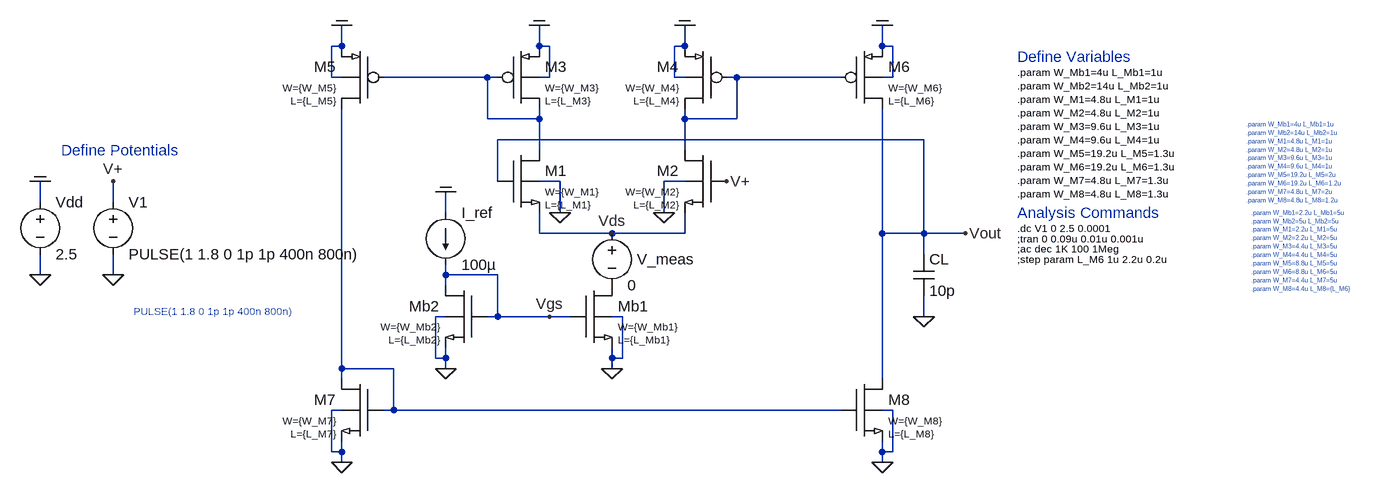
[diagram p0: schematic Wide_Output_OTA.asc]
Wide_Output_OTA.asc, the LTspice schematic file:
Version 4
SHEET 1 1488 680
WIRE -80 -96 -80 -128
WIRE -80 -96 -96 -96
WIRE 224 -96 224 -128
WIRE 240 -96 224 -96
WIRE 448 -96 448 -128
WIRE 448 -96 432 -96
WIRE 752 -96 752 -128
WIRE 768 -96 752 -96
WIRE -96 -48 -96 -96
WIRE -80 -48 -96 -48
WIRE 144 -48 -16 -48
WIRE 160 -48 144 -48
WIRE 240 -48 240 -96
WIRE 240 -48 224 -48
WIRE 432 -48 432 -96
WIRE 448 -48 432 -48
WIRE 528 -48 512 -48
WIRE 688 -48 528 -48
WIRE 768 -48 768 -96
WIRE 768 -48 752 -48
WIRE 144 16 144 -48
WIRE 224 16 224 0
WIRE 224 16 144 16
WIRE 448 16 448 0
WIRE 528 16 528 -48
WIRE 528 16 448 16
WIRE 816 48 160 48
WIRE 224 64 224 16
WIRE 448 64 448 16
WIRE 160 112 160 48
WIRE 256 112 224 112
WIRE 448 112 416 112
WIRE -544 144 -544 112
WIRE -432 144 -432 112
WIRE 80 160 80 128
WIRE 256 160 256 112
WIRE 416 160 416 112
WIRE 224 192 224 160
WIRE 336 192 224 192
WIRE 448 192 448 160
WIRE 448 192 336 192
WIRE 752 192 752 0
WIRE 816 192 816 48
WIRE 816 192 752 192
WIRE 880 192 816 192
WIRE 816 224 816 192
WIRE -544 256 -544 224
WIRE -432 256 -432 224
WIRE 80 256 80 240
WIRE 160 256 80 256
WIRE 80 272 80 256
WIRE 80 320 64 320
WIRE 160 320 160 256
WIRE 160 320 144 320
WIRE 240 320 160 320
WIRE 272 320 240 320
WIRE 352 320 336 320
WIRE 816 320 816 288
WIRE 64 384 64 320
WIRE 80 384 80 368
WIRE 80 384 64 384
WIRE 336 384 336 368
WIRE 352 384 352 320
WIRE 352 384 336 384
WIRE -80 400 -80 0
WIRE 0 400 -80 400
WIRE 80 400 80 384
WIRE 336 400 336 384
WIRE -80 416 -80 400
WIRE 752 416 752 192
WIRE -80 464 -96 464
WIRE 0 464 0 400
WIRE 0 464 -16 464
WIRE 688 464 0 464
WIRE 768 464 752 464
WIRE -96 528 -96 464
WIRE -80 528 -80 512
WIRE -80 528 -96 528
WIRE 752 528 752 512
WIRE 768 528 768 464
WIRE 768 528 752 528
WIRE -80 544 -80 528
WIRE 752 544 752 528
FLAG 80 400 0
FLAG 336 400 0
FLAG -80 544 0
FLAG 752 544 0
FLAG -80 -128 COM
FLAG 224 -128 COM
FLAG 448 -128 COM
FLAG 752 -128 COM
FLAG 256 160 0
FLAG 416 160 0
FLAG 80 128 COM
FLAG -544 112 COM
FLAG -544 256 0
FLAG 512 112 V+
FLAG -432 256 0
FLAG 816 320 0
FLAG 880 192 Vout
FLAG -432 112 V+
FLAG 336 192 Vds
FLAG 240 320 Vgs
SYMBOL EE551\\NMOS4 160 112 R0
WINDOW 123 73 16 Left 1
WINDOW 39 73 36 Left 1
SYMATTR Value2 W={W_M1}
SYMATTR SpiceLine L={L_M1}
SYMATTR InstName M1
SYMBOL EE551\\NMOS4 512 112 M0
WINDOW 123 73 16 Left 1
WINDOW 39 73 36 Left 1
SYMATTR Value2 W={W_M2}
SYMATTR SpiceLine L={L_M2}
SYMATTR InstName M2
SYMBOL EE551\\NMOS4 272 320 R0
WINDOW 123 73 16 Left 1
WINDOW 39 73 36 Left 1
SYMATTR Value2 W={W_Mb1}
SYMATTR SpiceLine L={L_Mb1}
SYMATTR InstName Mb1
SYMBOL EE551\\NMOS4 144 320 M0
WINDOW 123 73 16 Left 1
WINDOW 39 73 36 Left 1
SYMATTR Value2 W={W_Mb2}
SYMATTR SpiceLine L={L_Mb2}
SYMATTR InstName Mb2
SYMBOL current 80 160 R0
SYMATTR InstName I_ref
SYMATTR Value 100µ
SYMBOL EE551\\PMOS4 160 -48 R0
WINDOW 123 73 16 Left 1
WINDOW 39 73 36 Left 1
SYMATTR Value2 W={W_M3}
SYMATTR SpiceLine L={L_M3}
SYMATTR InstName M3
SYMBOL EE551\\PMOS4 512 -48 M0
WINDOW 123 73 16 Left 1
WINDOW 39 73 36 Left 1
SYMATTR Value2 W={W_M4}
SYMATTR SpiceLine L={L_M4}
SYMATTR InstName M4
SYMBOL EE551\\PMOS4 -16 -48 M0
WINDOW 123 73 16 Left 1
WINDOW 39 73 36 Left 1
SYMATTR Value2 W={W_M5}
SYMATTR SpiceLine L={L_M5}
SYMATTR InstName M5
SYMBOL EE551\\PMOS4 688 -48 R0
WINDOW 123 73 16 Left 1
WINDOW 39 73 36 Left 1
SYMATTR Value2 W={W_M6}
SYMATTR SpiceLine L={L_M6}
SYMATTR InstName M6
SYMBOL EE551\\NMOS4 -16 464 M0
WINDOW 123 73 16 Left 1
WINDOW 39 73 36 Left 1
SYMATTR Value2 W={W_M7}
SYMATTR SpiceLine L={L_M7}
SYMATTR InstName M7
SYMBOL EE551\\NMOS4 688 464 R0
WINDOW 123 73 16 Left 1
WINDOW 39 73 36 Left 1
SYMATTR Value2 W={W_M8}
SYMATTR SpiceLine L={L_M8}
SYMATTR InstName M8
SYMBOL voltage -544 128 R0
SYMATTR InstName Vdd
SYMATTR Value 2.5
SYMBOL voltage -432 128 R0
WINDOW 123 24 124 Left 2
WINDOW 39 0 0 Left 0
SYMATTR InstName V1
SYMATTR Value PULSE(1 1.8 0 1p 1p 400n 800n)
SYMBOL cap 800 224 R0
SYMATTR InstName CL
SYMATTR Value 10p
SYMBOL voltage 336 176 R0
WINDOW 0 38 56 Left 2
SYMATTR InstName V_meas
SYMATTR Value 0
TEXT 960 -80 Left 2 ;Define Variables
TEXT 960 -56 Left 1 !.param W_Mb1=4u L_Mb1=1u\n.param W_Mb2=14u L_Mb2=1u\n.param W_M1=4.8u L_M1=1u\n.param W_M2=4.8u L_M2=1u\n.param W_M3=9.6u L_M3=1u\n.param W_M4=9.6u L_M4=1u\n.param W_M5=19.2u L_M5=1.3u\n.param W_M6=19.2u L_M6=1.3u\n.param W_M7=4.8u L_M7=1.3u\n.param W_M8=4.8u L_M8=1.3u
TEXT -512 64 Left 2 ;Define Potentials
TEXT 960 160 Left 2 ;Analysis Commands
TEXT 960 184 Left 1 !.dc V1 0 2.5 0.0001
TEXT 960 200 Left 1 !;tran 0 0.09u 0.01u 0.001u
TEXT -400 312 Left 1 ;PULSE(1 1.8 0 1p 1p 400n 800n)
TEXT 1312 24 Left 0 ;.param W_Mb1=4u L_Mb1=1u\n.param W_Mb2=14u L_Mb2=1u\n.param W_M1=4.8u L_M1=1u\n.param W_M2=4.8u L_M2=1u\n.param W_M3=9.6u L_M3=1u\n.param W_M4=9.6u L_M4=1u\n.param W_M5=19.2u L_M5=2u\n.param W_M6=19.2u L_M6=1.2u\n.param W_M7=4.8u L_M7=2u\n.param W_M8=4.8u L_M8=1.2u
TEXT 960 232 Left 1 !;step param L_M6 1u 2.2u 0.2u
TEXT 960 216 Left 1 !;ac dec 1K 100 1Meg
TEXT 1320 160 Left 0 ;.param W_Mb1=2.2u L_Mb1=5u\n.param W_Mb2=5u L_Mb2=5u\n.param W_M1=2.2u L_M1=5u\n.param W_M2=2.2u L_M2=5u\n.param W_M3=4.4u L_M3=5u\n.param W_M4=4.4u L_M4=5u\n.param W_M5=8.8u L_M5=5u\n.param W_M6=8.8u L_M6=5u\n.param W_M7=4.4u L_M7=5u\n.param W_M8=4.4u L_M8={L_M6}

The netlist it stands for:
* Wide_Output_OTA.asc
XM1 N001 Vout Vds 0 NFET W={W_M1} L={L_M1}  ; pins Vd Vg Vs Vb
XM2 N002 V+ Vds 0 NFET W={W_M2} L={L_M2}  ; pins Vd Vg Vs Vb
XMb1 P001 Vgs 0 0 NFET W={W_Mb1} L={L_Mb1}  ; pins Vd Vg Vs Vb
XMb2 Vgs Vgs 0 0 NFET W={W_Mb2} L={L_Mb2}  ; pins Vd Vg Vs Vb
I_ref COM Vgs 100µ
XM3 N001 N001 COM COM PFET W={W_M3} L={L_M3}  ; pins Vd Vg Vs Vw
XM4 N002 N002 COM COM PFET W={W_M4} L={L_M4}  ; pins Vd Vg Vs Vw
XM5 N003 N001 COM COM PFET W={W_M5} L={L_M5}  ; pins Vd Vg Vs Vw
XM6 Vout N002 COM COM PFET W={W_M6} L={L_M6}  ; pins Vd Vg Vs Vw
XM7 N003 N003 0 0 NFET W={W_M7} L={L_M7}  ; pins Vd Vg Vs Vb
XM8 Vout N003 0 0 NFET W={W_M8} L={L_M8}  ; pins Vd Vg Vs Vb
Vdd COM 0 2.5
V1 V+ 0 PULSE(1 1.8 0 1p 1p 400n 800n)
CL Vout 0 10p
V_meas Vds P001 0
* Define Variables
.param W_Mb1=4u L_Mb1=1u
.param W_Mb2=14u L_Mb2=1u
.param W_M1=4.8u L_M1=1u
.param W_M2=4.8u L_M2=1u
.param W_M3=9.6u L_M3=1u
.param W_M4=9.6u L_M4=1u
.param W_M5=19.2u L_M5=1.3u
.param W_M6=19.2u L_M6=1.3u
.param W_M7=4.8u L_M7=1.3u
.param W_M8=4.8u L_M8=1.3u
* Define Potentials
* Analysis Commands
.dc V1 0 2.5 0.0001
;tran 0 0.09u 0.01u 0.001u
* PULSE(1 1.8 0 1p 1p 400n 800n)
* .param W_Mb1=4u L_Mb1=1u
* .param W_Mb2=14u L_Mb2=1u
* .param W_M1=4.8u L_M1=1u
* .param W_M2=4.8u L_M2=1u
* .param W_M3=9.6u L_M3=1u
* .param W_M4=9.6u L_M4=1u
* .param W_M5=19.2u L_M5=2u
* .param W_M6=19.2u L_M6=1.2u
* .param W_M7=4.8u L_M7=2u
* .param W_M8=4.8u L_M8=1.2u
;step param L_M6 1u 2.2u 0.2u
;ac dec 1K 100 1Meg
* .param W_Mb1=2.2u L_Mb1=5u
* .param W_Mb2=5u L_Mb2=5u
* .param W_M1=2.2u L_M1=5u
* .param W_M2=2.2u L_M2=5u
* .param W_M3=4.4u L_M3=5u
* .param W_M4=4.4u L_M4=5u
* .param W_M5=8.8u L_M5=5u
* .param W_M6=8.8u L_M6=5u
* .param W_M7=4.4u L_M7=5u
* .param W_M8=4.4u L_M8={L_M6}
.lib ee551.lib
.backanno
.end